# EAGLE design bluetooth_adapter (EAGLE 7.5.0)
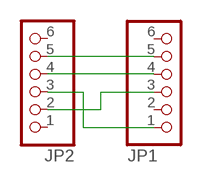
[diagram p0: schematic, sheet 1]

## Parts
JP1  PINHD-1X6  [1X06]
JP2  PINHD-1X6  [1X06]

## Nets
N$1: JP1.5 JP2.5
N$2: JP1.4 JP2.4
N$3: JP1.1 JP2.3
N$4: JP1.3 JP2.2
Unconnected: JP1.2 JP1.6 JP2.1 JP2.6

## Library data of the parts
JP1 JP2 = pinhead:PINHD-1X6: PIN HEADER

## Board
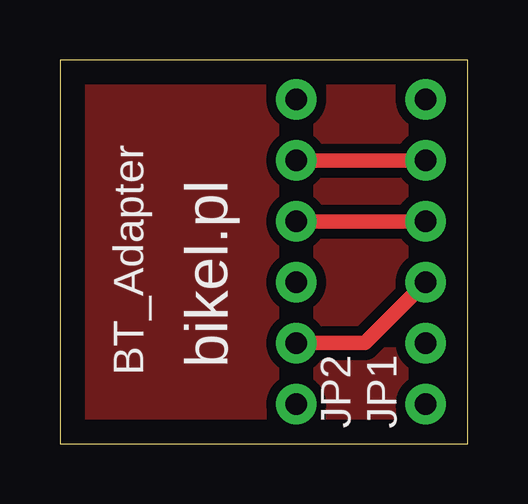
[diagram p1: board, top side]
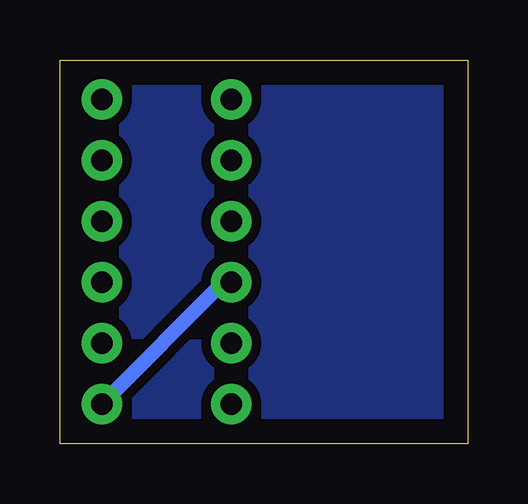
[diagram p2: board, bottom side, seen from below]

Size 17 x 16 mm. Coordinates in mm from the lower left corner, seen from the top.
Outline: 0,0 17,0 17,16 0,16 0,0
Copper layers (1*16): Top 0.035mm / dielectric 1.5mm / Bottom 0.035mm
Design rules "default": minimum track width 10mil, minimum drill 24mil, track to track 8mil, track to pad 8mil, pad to pad 8mil, via to via 8mil, smd to smd 8mil, copper to edge 40mil, drill to drill 8mil, minimum pad ring 10mil, minimum via ring 8mil, stop-mask expansion 4mil, vias tented up to drill 0mil, thermal gap 10mil

### Footprints (pad centres in the part's own frame; a part is rotated, then mirrored left to right if it is on the bottom)
1X06 = drill 0.9 pad 1.676: 1 -6.35,0; 2 -3.81,0; 3 -1.27,0; 4 1.27,0; 5 3.81,0; 6 6.35,0

### Placement (x,y rotation side)
JP1  15.25,8 90 top
JP2  9.85,8 90 top

### Tracks (layer width: path | path; a pad name or v marks a point on that pad's centre or on a via)
GND
  pour Bottom (isolate 0.406): 0,16.51 17.14,16.51 17.14,-0.32 0,-0.32
  pour Top (isolate 0.406): -0.32,16.51 17.78,16.51 17.78,-0.32 -0.32,-0.32
N$1
  Top 0.61: JP2.5 JP1.5
N$2
  Top 0.61: JP2.4 JP1.4
N$3
  Bottom 0.61: JP2.3 10.17,6.73 JP1.1
N$4
  Top 0.61: JP2.2 12.71,4.19 JP1.3

### Text on the board
tNames: BT_Adapter | bikel.pl